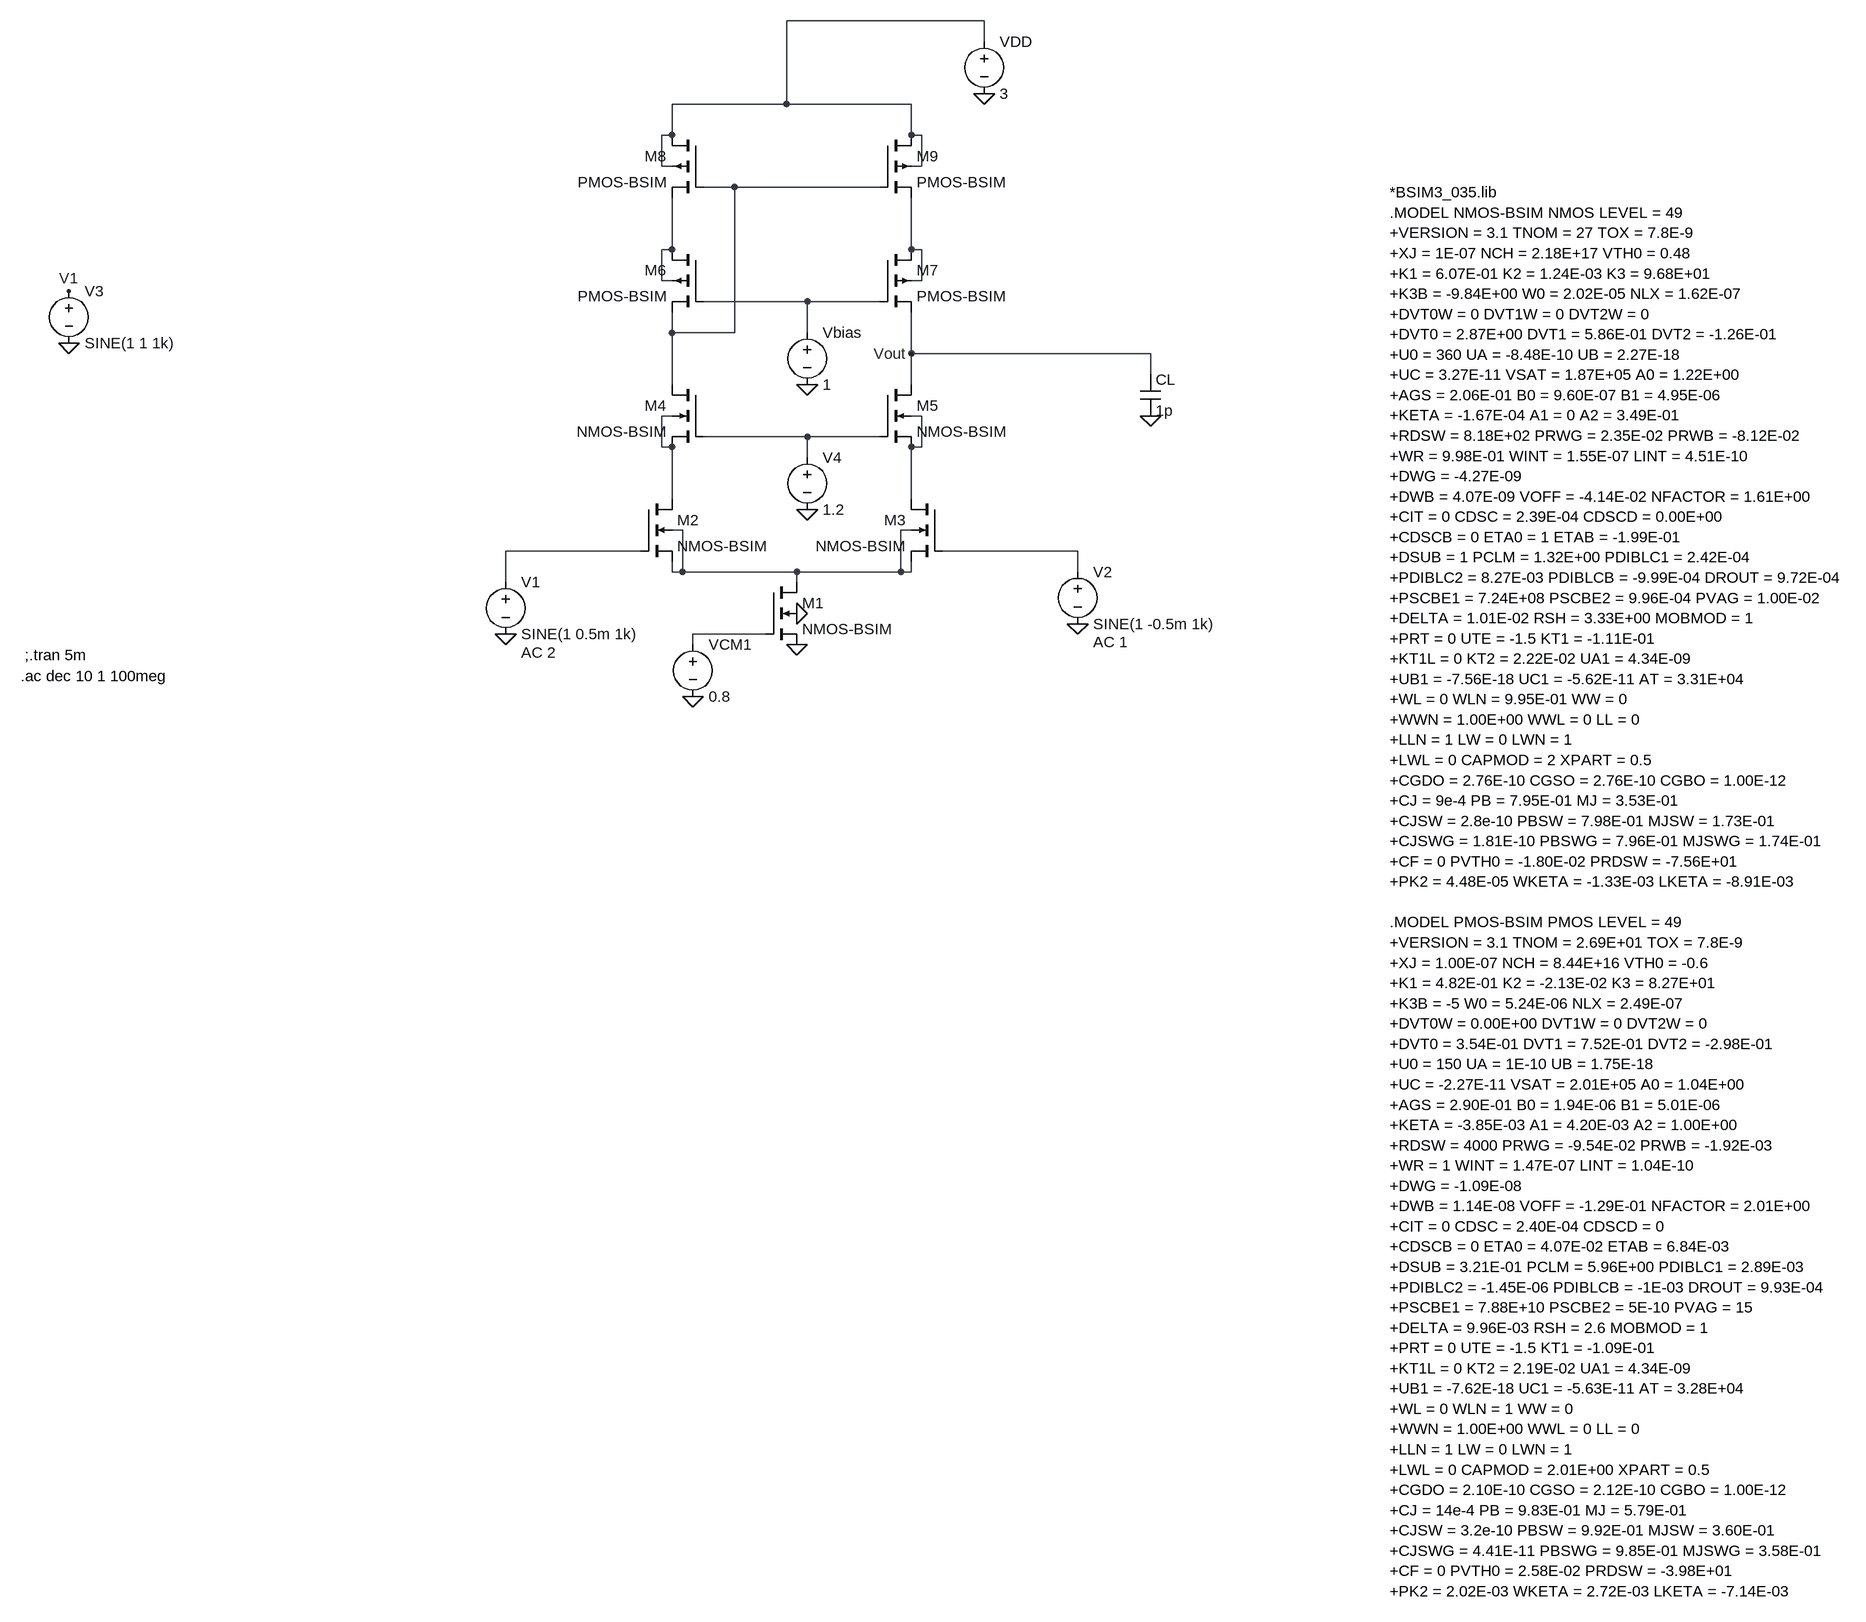
[diagram p0: schematic Cascode_diff_Amplifier.asc]
Cascode_diff_Amplifier.asc, the LTspice schematic file:
Version 4
SHEET 1 1832 1784
WIRE 464 -448 160 -448
WIRE 464 -416 464 -448
WIRE 160 -320 160 -448
WIRE 160 -320 -16 -320
WIRE 352 -320 160 -320
WIRE -16 -272 -16 -320
WIRE -16 -272 -32 -272
WIRE 352 -272 352 -320
WIRE 368 -272 352 -272
WIRE -32 -224 -32 -272
WIRE -16 -224 -32 -224
WIRE 368 -224 368 -272
WIRE 368 -224 352 -224
WIRE 80 -192 32 -192
WIRE 304 -192 80 -192
WIRE -16 -96 -16 -176
WIRE -16 -96 -32 -96
WIRE 352 -96 352 -176
WIRE 368 -96 352 -96
WIRE -32 -48 -32 -96
WIRE -16 -48 -32 -48
WIRE 368 -48 368 -96
WIRE 368 -48 352 -48
WIRE 192 -16 32 -16
WIRE 304 -16 192 -16
WIRE -16 32 -16 0
WIRE 80 32 80 -192
WIRE 80 32 -16 32
WIRE 192 32 192 -16
WIRE 352 64 352 0
WIRE 720 64 352 64
WIRE 720 96 720 64
WIRE -16 112 -16 32
WIRE 352 112 352 64
WIRE -16 160 -32 160
WIRE 368 160 352 160
WIRE 192 192 32 192
WIRE 304 192 192 192
WIRE -32 208 -32 160
WIRE -16 208 -32 208
WIRE 368 208 368 160
WIRE 368 208 352 208
WIRE 192 224 192 192
WIRE -16 288 -16 208
WIRE 352 288 352 208
WIRE 0 336 -16 336
WIRE 352 336 336 336
WIRE -64 368 -272 368
WIRE 608 368 400 368
WIRE -16 400 -16 384
WIRE 0 400 0 336
WIRE 0 400 -16 400
WIRE 176 400 0 400
WIRE 336 400 336 336
WIRE 336 400 176 400
WIRE 352 400 352 384
WIRE 352 400 336 400
WIRE 608 400 608 368
WIRE -272 416 -272 368
WIRE 176 416 176 400
WIRE 128 496 16 496
WIRE 16 512 16 496
FLAG -272 496 0
FLAG 16 592 0
FLAG 176 512 0
FLAG 608 480 0
FLAG 192 304 0
FLAG 192 112 0
FLAG 176 464 0
FLAG 464 -336 0
FLAG -944 48 0
FLAG -944 -32 V1
FLAG 352 64 Vout
FLAG 720 160 0
SYMBOL nmos4 128 416 R0
SYMATTR InstName M1
SYMATTR Value NMOS-BSIM
SYMATTR Value2 l=11.5u w=110u
SYMBOL nmos4 -64 288 R0
SYMATTR InstName M2
SYMATTR Value NMOS-BSIM
SYMATTR Value2 l=11.5u w=110u
SYMBOL nmos4 400 288 M0
SYMATTR InstName M3
SYMATTR Value NMOS-BSIM
SYMATTR Value2 l=11.5u w=110u
SYMBOL nmos4 32 112 M0
SYMATTR InstName M4
SYMATTR Value NMOS-BSIM
SYMATTR Value2 l=11.5u w=110u
SYMBOL nmos4 304 112 R0
SYMATTR InstName M5
SYMATTR Value NMOS-BSIM
SYMATTR Value2 l=11.5u w=110u
SYMBOL pmos4 32 -96 M0
SYMATTR InstName M6
SYMATTR Value PMOS-BSIM
SYMATTR Value2 l=3.75u w=20u
SYMBOL pmos4 304 -96 R0
SYMATTR InstName M7
SYMATTR Value PMOS-BSIM
SYMATTR Value2 l=3.75u w=20u
SYMBOL pmos4 32 -272 M0
SYMATTR InstName M8
SYMATTR Value PMOS-BSIM
SYMATTR Value2 l=3.75u w=20u
SYMBOL pmos4 304 -272 R0
SYMATTR InstName M9
SYMATTR Value PMOS-BSIM
SYMATTR Value2 l=3.75u w=20u
SYMBOL voltage -272 400 R0
WINDOW 123 24 124 Left 2
WINDOW 39 0 0 Left 0
SYMATTR Value2 AC 2
SYMATTR InstName V1
SYMATTR Value SINE(1 0.5m 1k)
SYMBOL voltage 608 384 R0
WINDOW 123 24 124 Left 2
WINDOW 39 0 0 Left 0
SYMATTR Value2 AC 1
SYMATTR InstName V2
SYMATTR Value SINE(1 -0.5m 1k)
SYMBOL voltage 16 496 R0
WINDOW 123 0 0 Left 0
WINDOW 39 0 0 Left 0
SYMATTR InstName VCM1
SYMATTR Value 0.8
SYMBOL voltage 192 208 R0
SYMATTR InstName V4
SYMATTR Value 1.2
SYMBOL voltage 192 16 R0
WINDOW 123 0 0 Left 0
WINDOW 39 0 0 Left 0
SYMATTR InstName Vbias
SYMATTR Value 1
SYMBOL voltage 464 -432 R0
WINDOW 123 0 0 Left 0
WINDOW 39 0 0 Left 0
SYMATTR InstName VDD
SYMATTR Value 3
SYMBOL voltage -944 -48 R0
WINDOW 123 0 0 Left 0
WINDOW 39 0 0 Left 0
SYMATTR InstName V3
SYMATTR Value SINE(1 1 1k)
SYMBOL cap 704 96 R0
SYMATTR InstName CL
SYMATTR Value 1p
TEXT 1088 -184 Left 2 !*BSIM3_035.lib\n.MODEL NMOS-BSIM NMOS LEVEL = 49\n+VERSION = 3.1 TNOM = 27 TOX = 7.8E-9\n+XJ = 1E-07 NCH = 2.18E+17 VTH0 = 0.48\n+K1 = 6.07E-01 K2 = 1.24E-03 K3 = 9.68E+01\n+K3B = -9.84E+00 W0 = 2.02E-05 NLX = 1.62E-07\n+DVT0W = 0 DVT1W = 0 DVT2W = 0\n+DVT0 = 2.87E+00 DVT1 = 5.86E-01 DVT2 = -1.26E-01\n+U0 = 360 UA = -8.48E-10 UB = 2.27E-18\n+UC = 3.27E-11 VSAT = 1.87E+05 A0 = 1.22E+00\n+AGS = 2.06E-01 B0 = 9.60E-07 B1 = 4.95E-06\n+KETA = -1.67E-04 A1 = 0 A2 = 3.49E-01\n+RDSW = 8.18E+02 PRWG = 2.35E-02 PRWB = -8.12E-02\n+WR = 9.98E-01 WINT = 1.55E-07 LINT = 4.51E-10\n+DWG = -4.27E-09\n+DWB = 4.07E-09 VOFF = -4.14E-02 NFACTOR = 1.61E+00\n+CIT = 0 CDSC = 2.39E-04 CDSCD = 0.00E+00\n+CDSCB = 0 ETA0 = 1 ETAB = -1.99E-01\n+DSUB = 1 PCLM = 1.32E+00 PDIBLC1 = 2.42E-04\n+PDIBLC2 = 8.27E-03 PDIBLCB = -9.99E-04 DROUT = 9.72E-04\n+PSCBE1 = 7.24E+08 PSCBE2 = 9.96E-04 PVAG = 1.00E-02\n+DELTA = 1.01E-02 RSH = 3.33E+00 MOBMOD = 1\n+PRT = 0 UTE = -1.5 KT1 = -1.11E-01\n+KT1L = 0 KT2 = 2.22E-02 UA1 = 4.34E-09\n+UB1 = -7.56E-18 UC1 = -5.62E-11 AT = 3.31E+04\n+WL = 0 WLN = 9.95E-01 WW = 0\n+WWN = 1.00E+00 WWL = 0 LL = 0\n+LLN = 1 LW = 0 LWN = 1\n+LWL = 0 CAPMOD = 2 XPART = 0.5\n+CGDO = 2.76E-10 CGSO = 2.76E-10 CGBO = 1.00E-12\n+CJ = 9e-4 PB = 7.95E-01 MJ = 3.53E-01\n+CJSW = 2.8e-10 PBSW = 7.98E-01 MJSW = 1.73E-01\n+CJSWG = 1.81E-10 PBSWG = 7.96E-01 MJSWG = 1.74E-01\n+CF = 0 PVTH0 = -1.80E-02 PRDSW = -7.56E+01\n+PK2 = 4.48E-05 WKETA = -1.33E-03 LKETA = -8.91E-03\n \n.MODEL PMOS-BSIM PMOS LEVEL = 49\n+VERSION = 3.1 TNOM = 2.69E+01 TOX = 7.8E-9\n+XJ = 1.00E-07 NCH = 8.44E+16 VTH0 = -0.6\n+K1 = 4.82E-01 K2 = -2.13E-02 K3 = 8.27E+01\n+K3B = -5 W0 = 5.24E-06 NLX = 2.49E-07\n+DVT0W = 0.00E+00 DVT1W = 0 DVT2W = 0\n+DVT0 = 3.54E-01 DVT1 = 7.52E-01 DVT2 = -2.98E-01\n+U0 = 150 UA = 1E-10 UB = 1.75E-18\n+UC = -2.27E-11 VSAT = 2.01E+05 A0 = 1.04E+00\n+AGS = 2.90E-01 B0 = 1.94E-06 B1 = 5.01E-06\n+KETA = -3.85E-03 A1 = 4.20E-03 A2 = 1.00E+00\n+RDSW = 4000 PRWG = -9.54E-02 PRWB = -1.92E-03\n+WR = 1 WINT = 1.47E-07 LINT = 1.04E-10\n+DWG = -1.09E-08\n+DWB = 1.14E-08 VOFF = -1.29E-01 NFACTOR = 2.01E+00\n+CIT = 0 CDSC = 2.40E-04 CDSCD = 0\n+CDSCB = 0 ETA0 = 4.07E-02 ETAB = 6.84E-03\n+DSUB = 3.21E-01 PCLM = 5.96E+00 PDIBLC1 = 2.89E-03\n+PDIBLC2 = -1.45E-06 PDIBLCB = -1E-03 DROUT = 9.93E-04\n+PSCBE1 = 7.88E+10 PSCBE2 = 5E-10 PVAG = 15\n+DELTA = 9.96E-03 RSH = 2.6 MOBMOD = 1\n+PRT = 0 UTE = -1.5 KT1 = -1.09E-01\n+KT1L = 0 KT2 = 2.19E-02 UA1 = 4.34E-09\n+UB1 = -7.62E-18 UC1 = -5.63E-11 AT = 3.28E+04\n+WL = 0 WLN = 1 WW = 0\n+WWN = 1.00E+00 WWL = 0 LL = 0\n+LLN = 1 LW = 0 LWN = 1\n+LWL = 0 CAPMOD = 2.01E+00 XPART = 0.5\n+CGDO = 2.10E-10 CGSO = 2.12E-10 CGBO = 1.00E-12\n+CJ = 14e-4 PB = 9.83E-01 MJ = 5.79E-01\n+CJSW = 3.2e-10 PBSW = 9.92E-01 MJSW = 3.60E-01\n+CJSWG = 4.41E-11 PBSWG = 9.85E-01 MJSWG = 3.58E-01\n+CF = 0 PVTH0 = 2.58E-02 PRDSW = -3.98E+01\n+PK2 = 2.02E-03 WKETA = 2.72E-03 LKETA = -7.14E-03
TEXT -1018 560 Left 2 !.ac dec 10 1 100meg
TEXT -1012 528 Left 2 !;.tran 5m

The netlist it stands for:
* Cascode_diff_Amplifier.asc
M1 N009 N012 0 0 NMOS-BSIM l=11.5u w=110u
M2 N006 N010 N009 N009 NMOS-BSIM l=11.5u w=110u
M3 N007 N011 N009 N009 NMOS-BSIM l=11.5u w=110u
M4 N002 N008 N006 N006 NMOS-BSIM l=11.5u w=110u
M5 Vout N008 N007 N007 NMOS-BSIM l=11.5u w=110u
M6 N003 N005 N002 N003 PMOS-BSIM l=3.75u w=20u
M7 N004 N005 Vout N004 PMOS-BSIM l=3.75u w=20u
M8 N001 N002 N003 N001 PMOS-BSIM l=3.75u w=20u
M9 N001 N002 N004 N001 PMOS-BSIM l=3.75u w=20u
V1 N010 0 SINE(1 0.5m 1k) AC 2
V2 N011 0 SINE(1 -0.5m 1k) AC 1
VCM1 N012 0 0.8
V4 N008 0 1.2
Vbias N005 0 1
VDD N001 0 3
V3 V1 0 SINE(1 1 1k)
CL Vout 0 1p
.model NMOS NMOS
.model PMOS PMOS
.lib standard.mos
*BSIM3_035.lib
.MODEL NMOS-BSIM NMOS LEVEL = 49
+VERSION = 3.1 TNOM = 27 TOX = 7.8E-9
+XJ = 1E-07 NCH = 2.18E+17 VTH0 = 0.48
+K1 = 6.07E-01 K2 = 1.24E-03 K3 = 9.68E+01
+K3B = -9.84E+00 W0 = 2.02E-05 NLX = 1.62E-07
+DVT0W = 0 DVT1W = 0 DVT2W = 0
+DVT0 = 2.87E+00 DVT1 = 5.86E-01 DVT2 = -1.26E-01
+U0 = 360 UA = -8.48E-10 UB = 2.27E-18
+UC = 3.27E-11 VSAT = 1.87E+05 A0 = 1.22E+00
+AGS = 2.06E-01 B0 = 9.60E-07 B1 = 4.95E-06
+KETA = -1.67E-04 A1 = 0 A2 = 3.49E-01
+RDSW = 8.18E+02 PRWG = 2.35E-02 PRWB = -8.12E-02
+WR = 9.98E-01 WINT = 1.55E-07 LINT = 4.51E-10
+DWG = -4.27E-09
+DWB = 4.07E-09 VOFF = -4.14E-02 NFACTOR = 1.61E+00
+CIT = 0 CDSC = 2.39E-04 CDSCD = 0.00E+00
+CDSCB = 0 ETA0 = 1 ETAB = -1.99E-01
+DSUB = 1 PCLM = 1.32E+00 PDIBLC1 = 2.42E-04
+PDIBLC2 = 8.27E-03 PDIBLCB = -9.99E-04 DROUT = 9.72E-04
+PSCBE1 = 7.24E+08 PSCBE2 = 9.96E-04 PVAG = 1.00E-02
+DELTA = 1.01E-02 RSH = 3.33E+00 MOBMOD = 1
+PRT = 0 UTE = -1.5 KT1 = -1.11E-01
+KT1L = 0 KT2 = 2.22E-02 UA1 = 4.34E-09
+UB1 = -7.56E-18 UC1 = -5.62E-11 AT = 3.31E+04
+WL = 0 WLN = 9.95E-01 WW = 0
+WWN = 1.00E+00 WWL = 0 LL = 0
+LLN = 1 LW = 0 LWN = 1
+LWL = 0 CAPMOD = 2 XPART = 0.5
+CGDO = 2.76E-10 CGSO = 2.76E-10 CGBO = 1.00E-12
+CJ = 9e-4 PB = 7.95E-01 MJ = 3.53E-01
+CJSW = 2.8e-10 PBSW = 7.98E-01 MJSW = 1.73E-01
+CJSWG = 1.81E-10 PBSWG = 7.96E-01 MJSWG = 1.74E-01
+CF = 0 PVTH0 = -1.80E-02 PRDSW = -7.56E+01
+PK2 = 4.48E-05 WKETA = -1.33E-03 LKETA = -8.91E-03
.MODEL PMOS-BSIM PMOS LEVEL = 49
+VERSION = 3.1 TNOM = 2.69E+01 TOX = 7.8E-9
+XJ = 1.00E-07 NCH = 8.44E+16 VTH0 = -0.6
+K1 = 4.82E-01 K2 = -2.13E-02 K3 = 8.27E+01
+K3B = -5 W0 = 5.24E-06 NLX = 2.49E-07
+DVT0W = 0.00E+00 DVT1W = 0 DVT2W = 0
+DVT0 = 3.54E-01 DVT1 = 7.52E-01 DVT2 = -2.98E-01
+U0 = 150 UA = 1E-10 UB = 1.75E-18
+UC = -2.27E-11 VSAT = 2.01E+05 A0 = 1.04E+00
+AGS = 2.90E-01 B0 = 1.94E-06 B1 = 5.01E-06
+KETA = -3.85E-03 A1 = 4.20E-03 A2 = 1.00E+00
+RDSW = 4000 PRWG = -9.54E-02 PRWB = -1.92E-03
+WR = 1 WINT = 1.47E-07 LINT = 1.04E-10
+DWG = -1.09E-08
+DWB = 1.14E-08 VOFF = -1.29E-01 NFACTOR = 2.01E+00
+CIT = 0 CDSC = 2.40E-04 CDSCD = 0
+CDSCB = 0 ETA0 = 4.07E-02 ETAB = 6.84E-03
+DSUB = 3.21E-01 PCLM = 5.96E+00 PDIBLC1 = 2.89E-03
+PDIBLC2 = -1.45E-06 PDIBLCB = -1E-03 DROUT = 9.93E-04
+PSCBE1 = 7.88E+10 PSCBE2 = 5E-10 PVAG = 15
+DELTA = 9.96E-03 RSH = 2.6 MOBMOD = 1
+PRT = 0 UTE = -1.5 KT1 = -1.09E-01
+KT1L = 0 KT2 = 2.19E-02 UA1 = 4.34E-09
+UB1 = -7.62E-18 UC1 = -5.63E-11 AT = 3.28E+04
+WL = 0 WLN = 1 WW = 0
+WWN = 1.00E+00 WWL = 0 LL = 0
+LLN = 1 LW = 0 LWN = 1
+LWL = 0 CAPMOD = 2.01E+00 XPART = 0.5
+CGDO = 2.10E-10 CGSO = 2.12E-10 CGBO = 1.00E-12
+CJ = 14e-4 PB = 9.83E-01 MJ = 5.79E-01
+CJSW = 3.2e-10 PBSW = 9.92E-01 MJSW = 3.60E-01
+CJSWG = 4.41E-11 PBSWG = 9.85E-01 MJSWG = 3.58E-01
+CF = 0 PVTH0 = 2.58E-02 PRDSW = -3.98E+01
+PK2 = 2.02E-03 WKETA = 2.72E-03 LKETA = -7.14E-03
.ac dec 10 1 100meg
;.tran 5m
.backanno
.end